# EAGLE design voltage_board (EAGLE 9.3.2)
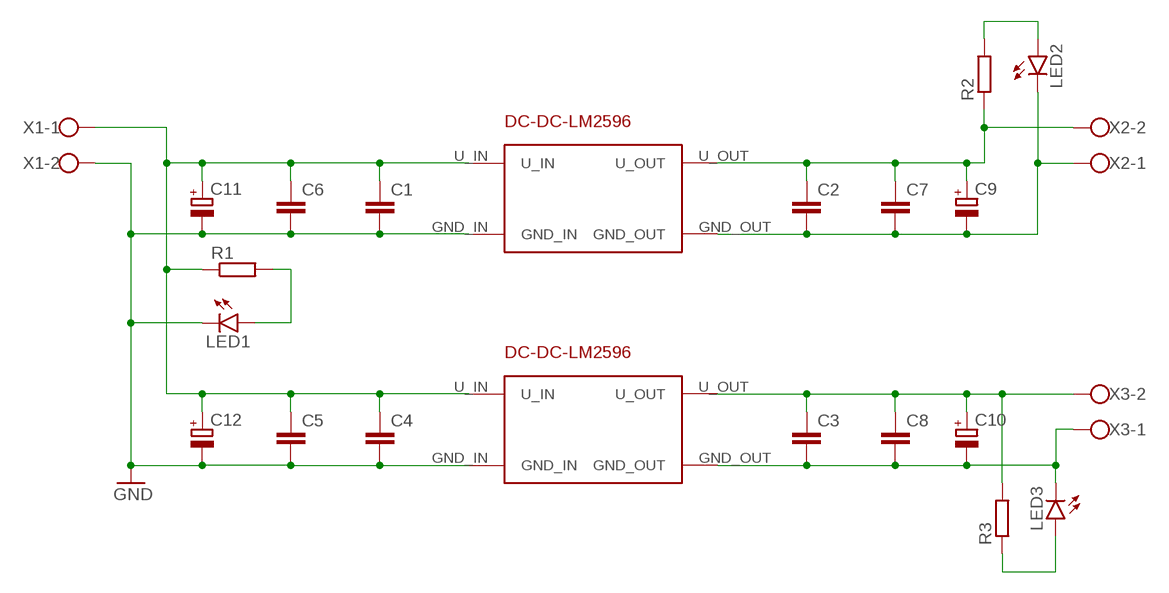
[diagram p0: schematic, sheet 1]

## Parts
C1  C-EUC1206  [C1206]
C2  C-EUC1206  [C1206]
C3  C-EUC1206  [C1206]
C4  C-EUC1206  [C1206]
C5  C-EUC1206  [C1206]
C6  C-EUC1206  [C1206]
C7  C-EUC1206  [C1206]
C8  C-EUC1206  [C1206]
C9  CPOL-EU140CLH-0810  [140CLH-0810]
C10  CPOL-EU140CLH-0810  [140CLH-0810]
C11  CPOL-EU140CLH-0810  [140CLH-0810]
C12  CPOL-EU140CLH-0810  [140CLH-0810]
LED1  LEDSML1206  [SML1206]
LED2  LEDSML1206  [SML1206]
LED3  LEDSML1206  [SML1206]
R1  R-EU_M1206  [M1206]
R2  R-EU_M1206  [M1206]
R3  R-EU_M1206  [M1206]
U$1  DC-DC-LM2596  [DC-DC-LM2596]
U$2  DC-DC-LM2596  [DC-DC-LM2596]
X1  W237-102  [W237-102]
X2  W237-102  [W237-102]
X3  W237-102  [W237-102]

## Nets
GND: C1.2 C4.2 C5.2 C6.2 C11.- C12.- LED1.C U$1.GND_IN U$2.GND_IN X1.2
N$1: LED1.A R1.2
N$2: C3.2 C8.2 C10.- LED3.C U$2.GND_OUT X3.1
N$3: LED2.A R2.2
N$4: C3.1 C8.1 C10.+ R3.2 U$2.U_OUT X3.2
N$5: C1.1 C4.1 C5.1 C6.1 C11.+ C12.+ R1.1 U$1.U_IN U$2.U_IN X1.1
N$7: C2.2 C7.2 C9.- LED2.C U$1.GND_OUT X2.1
N$8: C2.1 C7.1 C9.+ R2.1 U$1.U_OUT X2.2
N$9: LED3.A R3.1

## Library data of the parts
C1-C8 = rcl:C-EU: CAPACITOR, European symbol; SPICEPREFIX: C
C9-C12 = rcl:CPOL-EU: POLARIZED CAPACITOR, European symbol; SPICEPREFIX: C
LED1-LED3 = led:LED: LED OSRAM: - CHIPLED LG R971, LG N971, LY N971, LG Q971, LY Q971, LO R971, LY R971 LH N974, LH R974 LS Q976, LO Q976, LY Q976 LO Q996 - Hyper CHIPLED LW Q18S LB Q993, LB Q99A, LB R99A - SideLED LS A670, LO A670, LY A670, LG A670, LP A670 LB A673, LV A673, LT A673, LW A673 LH A674 LY A675 LS A676, LA A676, LO A676, LY A676, LW A676 LS A679, LY A679, LG A679 - Hyper Micro SIDELED® LS Y876, LA Y876, LO Y876, LY Y876 LT Y87S - SmartLED LW L88C, LW L88S LB L89C, LB L89S, LG L890 LS L89K, LO L89K, LY L89K LS L896, LA L896, LO L896, LY L896 - TOPLED LS T670, LO T670, LY T670, LG T670, LP T670 LSG T670, LSP T670, LSY T670, LOP T670, LYG T670 LG T671, LOG T671, LSG T671 LB T673, LV T673, LT T673, LW T673 LH T674 LS T676, LA T676, LO T676, LY T676, LB T676, LH T676, LSB T676, LW T676 LB T67C, LV T67C, LT T67C, LS T67K, LO T67K, LY T67K, LW E67C LS E67B, LA E67B, LO E67B, LY E67B, LB E67C, LV E67C, LT E67C LW T67C LS T679, LY T679, LG T679 LS T770, LO T770, LY T770, LG T770, LP T770 LB T773, LV T773, LT T773, LW T773 LH T774 LS E675, LA E675, LY E675, LS T675 LS T776, LA T776, LO T776, LY T776, LB T776 LHGB T686 LT T68C, LB T68C - Hyper Mini TOPLED® LB M676 - Mini TOPLED Santana® LG M470 LS M47K, LO M47K, LY M47K Source: http://www.osram.convergy.de LUXEON: - LUMILED® LXK2-PW12-R00, LXK2-PW12-S00, LXK2-PW14-U00, LXK2-PW14-V00 LXK2-PM12-R00, LXK2-PM12-S00, LXK2-PM14-U00 LXK2-PE12-Q00, LXK2-PE12-R00, LXK2-PE12-S00, LXK2-PE14-T00, LXK2-PE14-U00 LXK2-PB12-K00, LXK2-PB12-L00, LXK2-PB12-M00, LXK2-PB14-N00, LXK2-PB14-P00, LXK2-PB14-Q00 LXK2-PR12-L00, LXK2-PR12-M00, LXK2-PR14-Q00, LXK2-PR14-R00 LXK2-PD12-Q00, LXK2-PD12-R00, LXK2-PD12-S00 LXK2-PH12-R00, LXK2-PH12-S00 LXK2-PL12-P00, LXK2-PL12-Q00, LXK2-PL12-R00 Source: www.luxeon.com KINGBRIGHT: KA-3528ASYC Source: www.kingbright.com
R1-R3 = rcl:R-EU_: RESISTOR, European symbol; SPICEPREFIX: R
U$1 U$2 = gramofon:DC-DC-LM2596
X1-X3 = con-wago-500:W237-102: WAGO SCREW CLAMP; MPN: 237-102; OC_FARNELL: unknown; OC_NEWARK: 70K9898

## Board
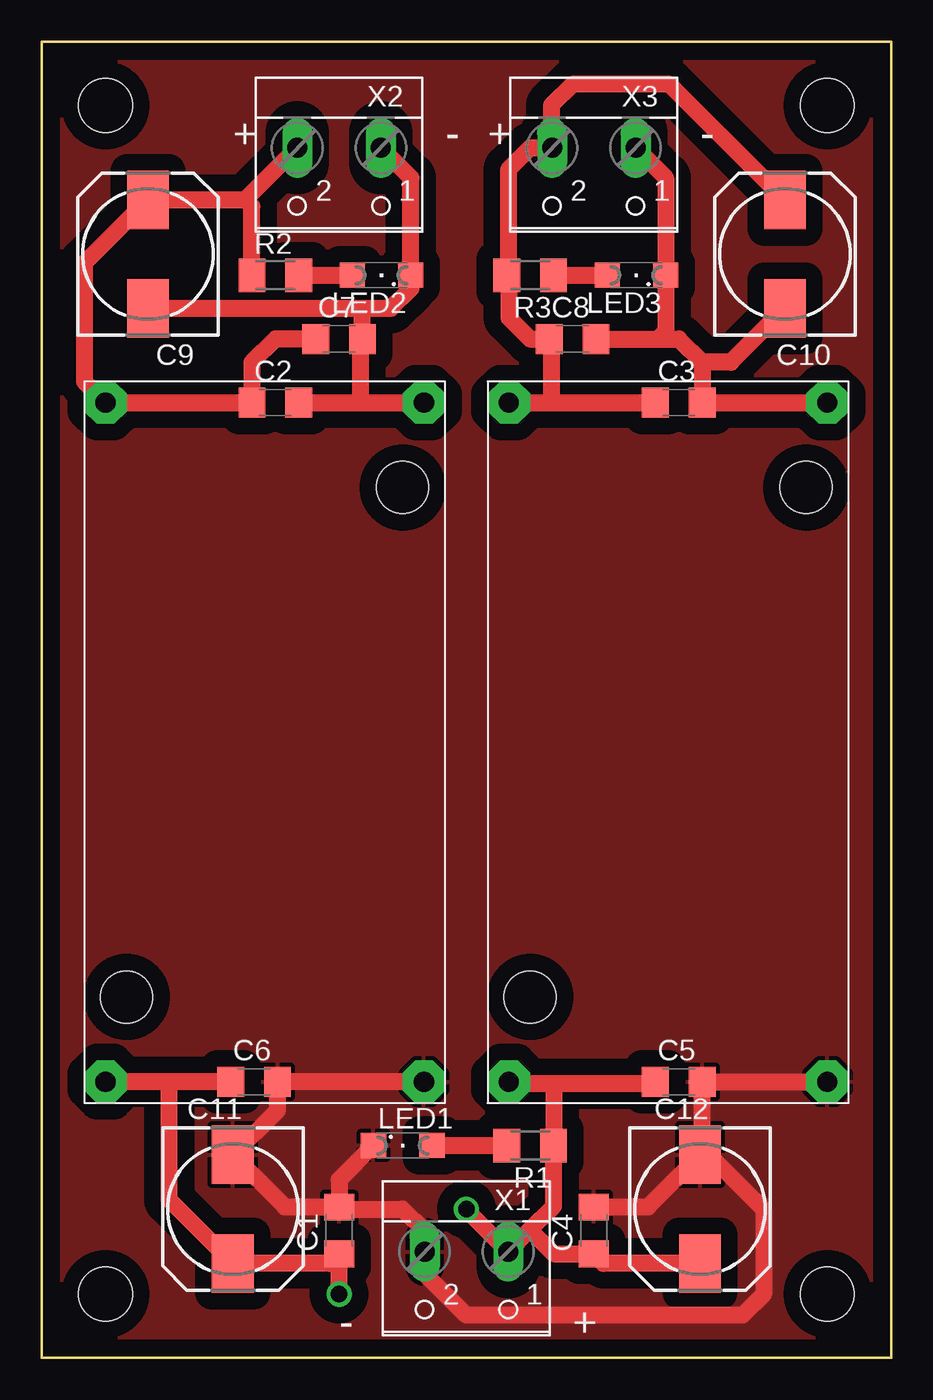
[diagram p1: board, top side]
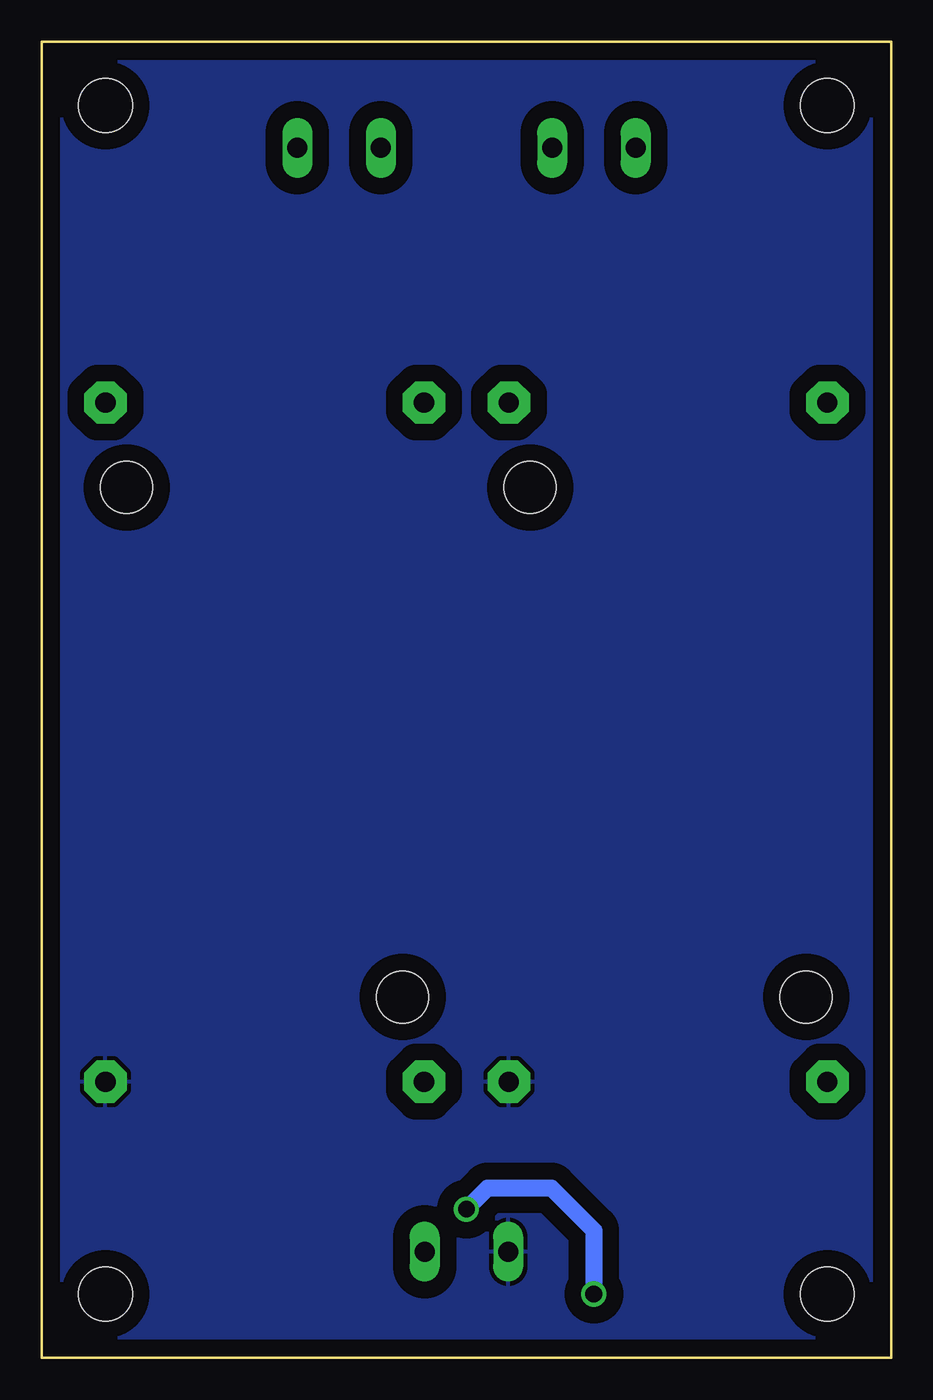
[diagram p2: board, bottom side, seen from below]

Size 50.8 x 78.74 mm. Coordinates in mm from the lower left corner, seen from the top.
Outline: 50.8,78.74 50.8,0 0,0 0,78.74 50.8,78.74
Copper layers (1*16): Top 0.035mm / dielectric 1.5mm / Bottom 0.035mm
Design rules "default": minimum track width 6mil, minimum drill 0.35mm, track to track 6mil, track to pad 6mil, pad to pad 6mil, via to via 6mil, smd to smd 6mil, copper to edge 40mil, drill to drill 6mil, minimum pad ring 10mil, minimum via ring 8mil, stop-mask expansion 4mil, vias tented up to drill 0mil, thermal gap 10mil
Holes 3.2 mm at 3.81,3.81 46.99,3.81 3.81,74.93 46.99,74.93

### Footprints (pad centres in the part's own frame; a part is rotated, then mirrored left to right if it is on the bottom)
C1206 = smd 1.6 x 1.8: 1 -1.4,0; 2 1.4,0
140CLH-0810 = smd 3.5 x 2.5: + 3.25,0; - -3.25,0
SML1206 = smd 1.5 x 1.5: A 1.75,0; C -1.75,0
M1206 = smd 1.6 x 2: 1 -1.4,0; 2 1.4,0
DC-DC-LM2596 = drill 1.2 pad 2.54 octagon: GND_IN 1.27,41.91; GND_OUT 1.27,1.27; U_IN 20.32,41.91; U_OUT 20.32,1.27 | hole 3.1: 2.54,6.35; 19.05,36.83
W237-102 = drill 1.194 long: 1 -2.5,-1.27; 2 2.5,-1.27

### Placement (x,y rotation side)
C1  17.78,7.62 90 top
C2  13.97,57.15 0 top
C3  38.1,57.15 0 top
C4  33.02,7.62 90 top
C5  38.1,16.51 0 top
C6  12.7,16.51 0 top
C7  17.78,60.96 0 top
C8  31.75,60.96 0 top
C9  6.35,66.04 90 top
C10  44.45,66.04 90 top
C11  11.43,8.89 270 top
C12  39.37,8.89 270 top
LED1  21.59,12.7 0 top
LED2  20.32,64.77 180 top
LED3  35.56,64.77 180 top
R1  29.21,12.7 180 top
R2  13.97,64.77 0 top
R3  29.21,64.77 180 top
U$1  24.13,58.42 180 top
U$2  48.26,58.42 180 top
X1  25.4,5.08 180 top
X2  17.78,71.12 180 top
X3  33.02,71.12 180 top

### Tracks (layer width: path | path; a pad name or v marks a point on that pad's centre or on a via)
GND
  Top 1.016: C1.2 14.55,9.02 C11.- 14.1,14.81 C6.2 U$1.GND_IN | LED1.C 17.78,10.64 C1.2 | C1.2 17.91,8.89 21.59,8.89 22.9,7.58 X1.2 22.9,5.12 22.86,5.08 25.4,2.54 41.91,2.54 43.18,3.81 43.18,8.89 39.93,12.14 C12.- | U$2.GND_IN C5.2 39.5,12.27 C12.- | C4.2 36.25,9.02 C12.-
  pour Top (isolate 1): 0,78.74 50.8,78.74 50.8,0 0,0
  pour Bottom (isolate 1): 0,78.74 50.8,78.74 50.8,0 0,0
N$1
  Top 1.016: LED1.A R1.2
N$2
  Top 1.016: U$2.GND_OUT C3.2 39.5,59.56 | X3.1 37.31,70.6 LED3.C 37.31,61.44 36.83,60.96 | C8.2 36.83,60.96 | 36.83,60.96 38.1,60.96 39.5,59.56 | C10.- 41.22,59.56 39.5,59.56
N$3
  Top 1.016: R2.2 LED2.A
N$4
  Top 1.016: U$2.U_OUT 30.48,57.15 | 30.48,57.15 C3.1 | 30.48,57.15 30.48,60.83 C8.1 29.21,60.96 27.94,62.23 27.94,64.64 R3.2 27.94,64.9 27.94,71.12 29.21,72.39 X3.2 30.48,72.43 30.48,74.93 31.75,76.2 37.54,76.2 C10.+
N$5  (via drill 1)
  Top 1.016: 29.19,7.64 X1.1 25.4,8.85 v25.4,8.89 | 29.19,7.64 30.61,9.06 R1.1 30.61,16.38 | 29.19,7.64 30.61,6.22 C4.1 33.6,5.64 C12.+ | C5.1 36.57,16.38 30.61,16.38 | 30.61,16.38 28.07,16.38 U$2.U_IN | C6.1 7.62,16.51 | 7.62,16.51 U$1.U_IN | 7.62,16.51 7.62,9.45 C11.+ 17.2,5.64 C1.1 v17.78,3.81
  Bottom 1.016: v25.4,8.89 24.13,10.16 20.32,10.16 17.78,7.62 v17.78,3.81
N$7
  Top 1.016: C2.2 19.05,57.15 | 19.05,57.15 U$1.GND_OUT | 19.05,57.15 19.05,60.83 C7.2 19.18,62.66 19.05,62.79 | X2.1 22.07,70.6 LED2.C 22.07,63.98 20.88,62.79 19.05,62.79 | C9.- 19.05,62.79
N$8
  Top 1.016: C7.1 13.97,60.96 12.57,59.56 C2.1 U$1.U_OUT 2.54,58.42 2.54,65.48 C9.+ 12.18,69.29 | 12.18,69.29 X2.2 | R2.1 12.57,68.9 12.18,69.29
N$9
  Top 1.016: R3.1 LED3.A

### Text on the board
tPlace: + | - | + | - | - | +